# Altium schematic sheet rel_ladder.SchDoc
size A4
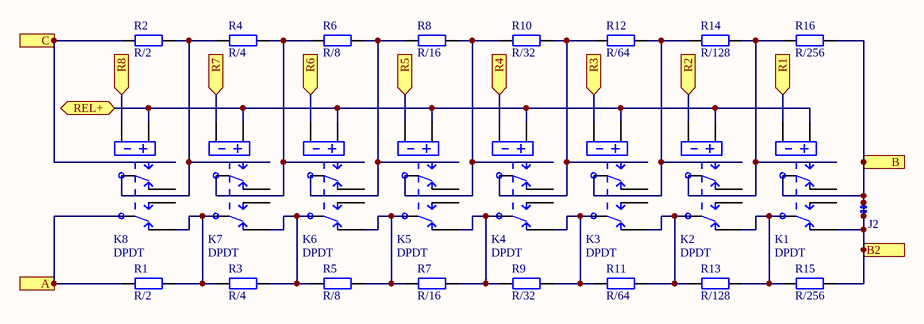
[diagram p0: rel_ladder.SchDoc]

## Parts
J2  JMP_mini  [solderJumper]  (value not drawn)
K1  DPDT  [AXICOM IM-G Relay]
K2  DPDT  [AXICOM IM-G Relay]
K3  DPDT  [AXICOM IM-G Relay]
K4  DPDT  [AXICOM IM-G Relay]
K5  DPDT  [AXICOM IM-G Relay]
K6  DPDT  [AXICOM IM-G Relay]
K7  DPDT  [AXICOM IM-G Relay]
K8  DPDT  [AXICOM IM-G Relay]
R1  R/2  [R2012_0805I_L]
R2  R/2  [R2012_0805I_L]
R3  R/4  [R2012_0805I_L]
R4  R/4  [R2012_0805I_L]
R5  R/8  [R2012_0805I_L]
R6  R/8  [R2012_0805I_L]
R7  R/16  [R2012_0805I_L]
R8  R/16  [R2012_0805I_L]
R9  R/32  [R2012_0805I_L]
R10  R/32  [R2012_0805I_L]
R11  R/64  [R2012_0805I_L]
R12  R/64  [R2012_0805I_L]
R13  R/128  [R2012_0805I_L]
R14  R/128  [R2012_0805I_L]
R15  R/256  [R2012_0805I_L]
R16  R/256  [R2012_0805I_L]

## Ports
A (in), B2 (in), B (in), C (in), R1 (in), R2 (in), R3 (in), R4 (in), R5 (in), R6 (in), R7 (in), R8 (in), REL+ (bidir)

## Nets
A: K8.6 R1.1 ; port A
B: J2.1 J2.2 K1.3 K1.7 R15.2 R16.2 ; port B, port B2
C: K8.4 R2.1 ; port C
R1: K1.8 ; port R1
R2: K2.8 ; port R2
R3: K3.8 ; port R3
R4: K4.8 ; port R4
R5: K5.8 ; port R5
R6: K6.8 ; port R6
R7: K7.8 ; port R7
R8: K8.8 ; port R8
REL+: K1.1 K2.1 K3.1 K4.1 K5.1 K6.1 K7.1 K8.1 ; port REL+
NetK1_4: K1.4 K2.3 R14.2 R16.1
NetK1_6: K1.6 K2.7 R13.2 R15.1
NetK2_4: K2.4 K3.3 R12.2 R14.1
NetK2_6: K2.6 K3.7 R11.2 R13.1
NetK3_4: K3.4 K4.3 R10.2 R12.1
NetK3_6: K3.6 K4.7 R9.2 R11.1
NetK4_4: K4.4 K5.3 R8.2 R10.1
NetK4_6: K4.6 K5.7 R7.2 R9.1
NetK5_4: K5.4 K6.3 R6.2 R8.1
NetK5_6: K5.6 K6.7 R5.2 R7.1
NetK6_4: K6.4 K7.3 R4.2 R6.1
NetK6_6: K6.6 K7.7 R3.2 R5.1
NetK7_4: K7.4 K8.3 R2.2 R4.1
NetK7_6: K7.6 K8.7 R1.2 R3.1

Not connected (* = marked no-connect by the designer): K1 2 5; K2 2 5; K3 2 5; K4 2 5; K5 2 5; K6 2 5; K7 2 5; K8 2 5

## Library data of the parts
K1-K8 = IM-GR Relay DPDT: TE CONNECTIVITY  IM-GR  RELAY, DPDT, NO; Farnell ID: 1175070; URL: http://si.farnell.com/te-connectivity-axicom/im06gr/relay-gull-wing-dpco-12vdc-2a/dp/1175070
R1-R16 = R